# Altium schematic sheet Sheet1.SchDoc
size A4
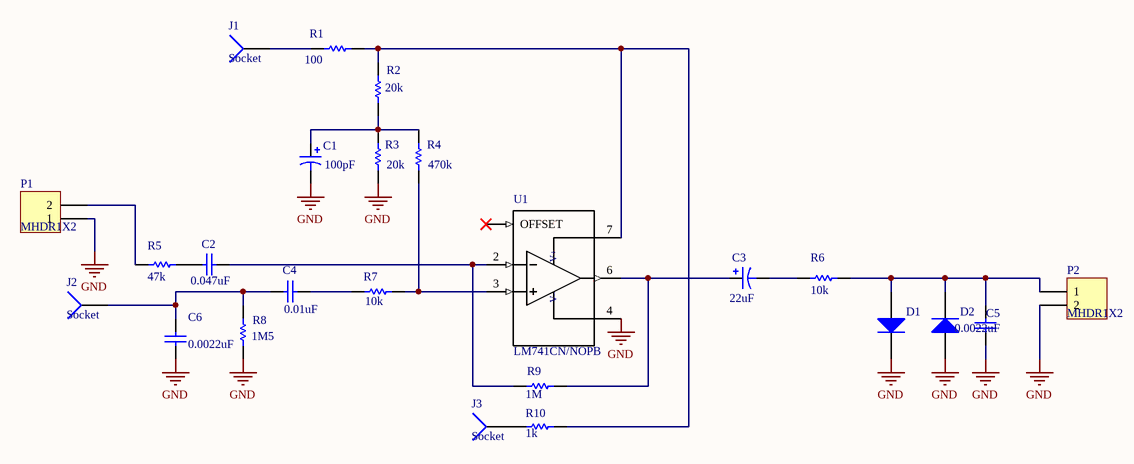
[diagram p0: Sheet1.SchDoc]

## Parts
C1  value 100pF  [PCBComponent_1]  (hidden comment: Cap Pol1)
C2  value 0.047uF  [PCBComponent_1]  (hidden comment: Cap)
C3  value 22uF  [PCBComponent_1]  (hidden comment: Cap Pol1)
C4  value 0.01uF  [PCBComponent_1]  (hidden comment: Cap)
C5  value 0.0022uF  [PCBComponent_1]  (hidden comment: Cap)
C6  value 0.0022uF  [PCBComponent_1]  (hidden comment: Cap)
D1  Diode 1N914  [DO-35]  (value not drawn)
D2  Diode 1N914  [DO-35]  (value not drawn)
J1  Socket  [PIN1]
J2  Socket  [PIN1]
J3  Socket  [PIN1]
P1  MHDR1X2  [MHDR1X2]
P2  MHDR1X2  [MHDR1X2]
R1  value 100  [AXIAL-0.3]  (hidden comment: Res1)
R2  value 20k  [AXIAL-0.3]  (hidden comment: Res1)
R3  value 20k  [AXIAL-0.3]  (hidden comment: Res1)
R4  value 470k  [AXIAL-0.3]  (hidden comment: Res1)
R5  value 47k  [AXIAL-0.3]  (hidden comment: Res1)
R6  value 10k  [AXIAL-0.3]  (hidden comment: Res1)
R7  value 10k  [AXIAL-0.3]  (hidden comment: Res1)
R8  value 1M5  [AXIAL-0.3]  (hidden comment: Res1)
R9  value 1M  [AXIAL-0.3]  (hidden comment: Res1)
R10  value 1k  [AXIAL-0.3]  (hidden comment: Res1)
U1  LM741CN/NOPB  [*DIP794W45P254L1016H508Q8]

## Nets
GND: C1.2 C5.2 C6.2 D1.2(K) D2.1(A) P1.1 P2.2 R3.2 R8.2 U1.4(V-)
NetC1_1: C1.1 R2.2 R3.1 R4.1
NetC2_1: C2.1 R5.2
NetC2_2: C2.2 R9.1 U1.2(INV_INPUT)
NetC3_1: C3.1 R9.2 U1.6(OUTPUT)
NetC3_2: C3.2 R6.1
NetC4_1: C4.1 C6.1 J2.1 R8.1
NetC4_2: C4.2 R7.1
NetC5_1: C5.1 D1.1(A) D2.2(K) P2.1 R6.2
NetJ1_1: J1.1 R1.1
NetJ3_1: J3.1 R10.1
NetP1_2: P1.2 R5.1
NetR1_2: R1.2 R2.1 R10.2 U1.7(V+)
NetR4_2: R4.2 R7.2 U1.3(NON-INV_INPUT)
NetU1_1: U1.1(OFFSET) U1.5(OFFSET)

## Notes on the sheet
- Title
- Size:
- Date:
- A4
- Number:
- Time:
- Revision:
- Sheet
- of
- File:

## Library data of the parts
C1 C3 = Cap Pol1: Polarized Capacitor (Radial); Published: 8-Jun-2000; LatestRevisionDate: 17-Jul-2002; LatestRevisionNote: Re-released for DXP Platform.; PackageReference: RB7.6-15; Publisher: Altium Limited; PackageDescription: Polarized Capacitor (Radial); 2 Leads
C2 C4-C6 = Cap: Capacitor; Published: 8-Jun-2000; LatestRevisionDate: 17-Jul-2002; LatestRevisionNote: Re-released for DXP Platform.; PackageReference: RAD-0.3; Publisher: Altium Limited; PackageDescription: Radial Cap, Thru-Hole; 2 Leads; 0.3 in Pin Spacing
D1 D2 = Diode 1N914: High Conductance Fast Diode; Published: 8-Jun-2000; LatestRevisionDate: 17-Jul-2002; LatestRevisionNote: Re-released for DXP Platform.; DatasheetVersion: 1997; PackageReference: DO-35; Publisher: Altium Limited; PackageDescription: Diode, Axial; Body 3.8 x 1.9 mm (LxDia. max), Lead Dia. 0.53 mm (max); Code_JEDEC: DO-204-AH; ComponentLink1Description: Manufacturer Link; ComponentLink1URL: http://www.fairchildsemi.com/; ComponentLink2Description: Datasheet; ComponentLink2URL: http://www.fairchildsemi.com/ds/1N%2F1N4448.pdf
P1 P2 = MHDR1X2: Header, 2-Pin; LatestRevisionDate: 17-Jul-2002; LatestRevisionNote: Re-released for DXP Platform.; Publisher: Altium Limited
R1-R10 = Res1: Resistor; Published: 8-Jun-2000; LatestRevisionDate: 17-Jul-2002; LatestRevisionNote: Re-released for DXP Platform.; PackageReference: AXIAL-0.3; Publisher: Altium Limited; PackageDescription: Axial Device, Thru-Hole; 2 Leads; 0.3 in Pin Spacing
U1 = LM741CN/NOPB: General Purpose Amplifier 1 Circuit 8-PDIP; MF: Texas Instruments; Package: DIP-8 Microsemi; MP: LM741CN/NOPB; Availability: Unavailable; Price: None; SnapEDA_Link: https://www.snapeda.com/parts/LM741CN/NOPB/Texas%20Instruments/view-part/74633/?ref=snap; Value: *
J1-J3 = Socket: LatestRevisionDate: 17-Jul-2002; LatestRevisionNote: Re-released for DXP Platform.; Publisher: Altium Limited